# Altium schematic sheet Power Schematic.SchDoc
size A4; SheetNumber: 2; SheetTotal: 3
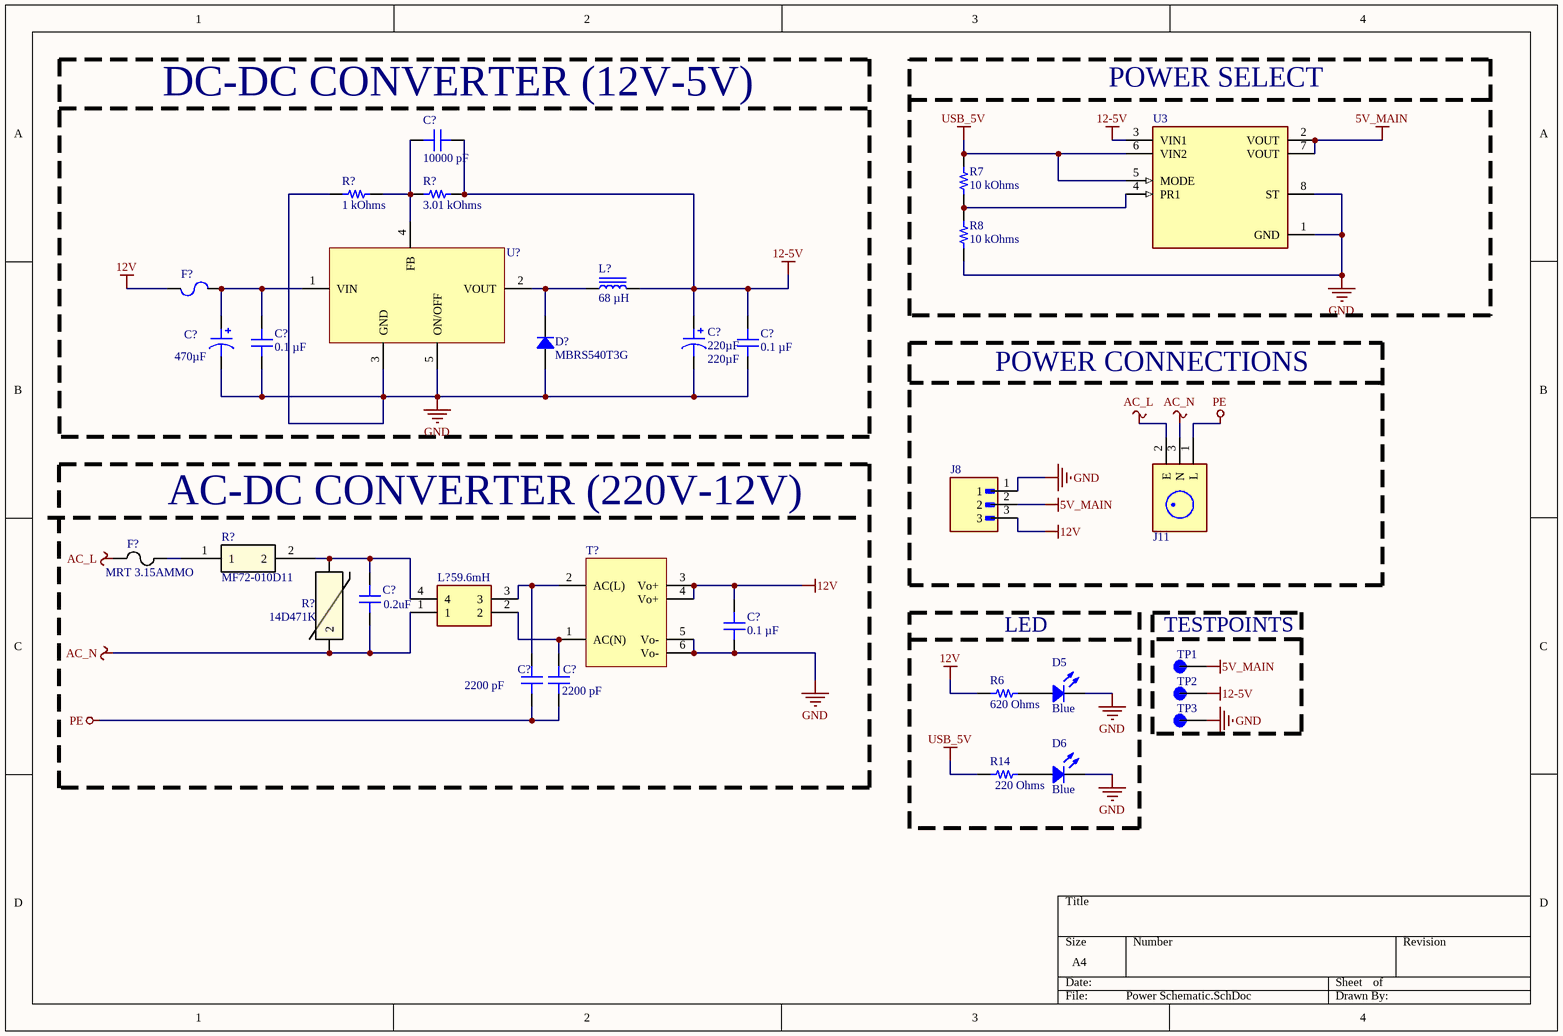
[diagram p0: Power Schematic.SchDoc]

## Parts
(Parts that share a designator on the sheet are numbered #1, #2 ... from top to bottom, then left to right.)
C?#1  10000 pF  [CAP 0603_1608]
C?#2  470µF  [CAP TH ALUM ELEC D12.50mm S5.00mm H27.00mm]
C?#3  0.1 µF  [CAP 0603_1608]
C?#4  220µF  [CAP TH ALUM ELEC D8.00mm S3.50mm H16.50mm]
C?#5  0.1 µF  [CAP 0603_1608]
C?#6  Capacitance: 0.2uF  [CAP_R46KI322040M2K_KEM]  (hidden comment: R46KI322040M2K)
C?#7  0.1 µF  [CAP 0603_1608]
C?#8  Capacitance: 2200 pF  [G10E1E222MN0B0S0N0]  (hidden comment: G10E1E222MN0B0S0N0)
C?#9  Capacitance: 2200 pF  [G10E1E222MN0B0S0N0]  (hidden comment: G10E1E222MN0B0S0N0)
D5  Blue  [LED 0805_2012 BLUE]
D6  Blue  [LED 0805_2012 BLUE]
D?  MBRS540T3G  [DO214AB SMC]
F?#1  SF-1206S300-2  [FUSE 0402_1005 0.51MM]  (value not drawn)
F?#2  MRT 3.15AMMO  [MRT_BEL]
J8  61300311121  [WURTH_61300311121]  (value not drawn)
J11  703W-00/52  [QUALTEK_703W-00/52]  (value not drawn)
L?#1  68 µH  [WURTH WE-PD 1210]
L?#2  value 59.6mH  [SSRH7HM04596]  (hidden comment: SSRH7H-M04596)
R6  620 Ohms  [YAGEO RES RK73 RS73 SG73 0805_2012]
R7  10 kOhms  [YAGEO RES 0603_1608]
R8  10 kOhms  [YAGEO RES 0603_1608]
R14  220 Ohms  [YAGEO RES 0805_2012]
R?#1  1 kOhms  [YAGEO RES 0603_1608]
R?#2  3.01 kOhms  [YAGEO RES 0603_1608]
R?#3  MF72-010D11  [MF72-010D11_CTM]
R?#4  14D471K  [VARS_B72214S_15p5x5p4-7p5_TDK]
T?  AP12N24  [POWER MODULE 49x36mm]  (value not drawn)
TP1  5115  [KEYSTONE_5115]  (value not drawn)
TP2  5115  [KEYSTONE_5115]  (value not drawn)
TP3  5115  [KEYSTONE_5115]  (value not drawn)
U3  TPS2116DRLR  [SOTFL50P160X60-8N]  (value not drawn)
U?  LM2596S-ADJ/NOPB  [LM2596]  (value not drawn)

## Blocks framed on the sheet
DC-DC CONVERTER (12V-5V): C?#1-C?#5 D? F?#1 L?#1 R?#1 R?#2 U?
POWER SELECT: R7 R8 U3
POWER CONNECTIONS: J8 J11
AC-DC CONVERTER (220V-12V): C?#6-C?#9 F?#2 L?#2 R?#3 R?#4 T?
LED: D5 D6 R6 R14
TESTPOINTS: TP1-TP3

## Nets
5V_MAIN: J8.2 TP1.TP U3.2(VOUT) U3.7(VOUT)
12-5V: C?#1.2 C?#4.1 C?#5.2 L?#1.2 R?#2.2 TP2.TP U3.3(VIN1)
12V: C?#7.2 F?#1.1 J8.3 R6.1 T?.3(Vo+) T?.4(Vo+)
AC_L: F?#2.1 J11.2(E)
AC_N: C?#6.1 J11.3(N) L?#2.1 R?#4.2
GND: C?#2.2 C?#3.1 C?#4.2 C?#5.1 C?#7.1 D5.2 D6.2 D?.1 J8.1 R8.1 R?#1.1 T?.5(Vo-) T?.6(Vo-) TP3.TP U3.1(GND) U3.8(ST) U?.3(GND) U?.5(ON/OFF)
PE: C?#8.1 C?#9.1 J11.1(L)
USB_5V: R7.2 R14.1 U3.5(MODE) U3.6(VIN2)
NetC?#1_1: C?#1.1 R?#1.2 R?#2.1 U?.4(FB)
NetC?#2_1: C?#2.1 C?#3.2 F?#1.2 U?.1(VIN)
NetC?#6_2: C?#6.2 L?#2.4 R?#3.2 R?#4.1
NetC?#8_2: C?#8.2 L?#2.3 T?.2(AC(L))
NetC?#9_2: C?#9.2 L?#2.2 T?.1(AC(N))
NetD5_1: D5.1 R6.2
NetD6_1: D6.1 R14.2
NetD?_2: D?.2 L?#1.1 U?.2(VOUT)
NetF?#2_2: F?#2.2 R?#3.1
NetR7_1: R7.1 R8.2 U3.4(PR1)

## Library data of the parts
C?#1 = KAF15AR71H103KT: CAP CER 10000PF 50V X7R 0603; manufacturer: KYOCERA AVX; Tolerance: ±10%; Part Number: KAF15AR71H103KT; Applications: Automotive, Boardflex Sensitive; componentlink1description: Datasheet; componentlink1url: https://datasheets.kyocera-avx.com/AutoMLCC.pdf; componentlink2description: DigiKey Link; componentlink2url: https://www.digikey.com/en/products/detail/kyocera-avx/KAF15AR71H103KT/3660860; Device Package: 0603 (1608 Metric); Features: Soft Termination; lastupdated: 9.02.2024 20:09:12; Lifecycle Status: Active; Minimum Order: 1; Mounting Type: Surface Mount, MLCC; Operating Temperature: -55°C ~ 125°C; Package / Case: 0603 (1608 Metric); packaging: TapeAndReel; partid: 52545; Part Status: Active; price: 0.03; Ratings: AEC-Q200; series: FLEXITERM®; Size / Dimension: 0.063" L x 0.032" W (1.60mm x 0.81mm); Supplier 1: DigiKey; Supplier Part Number 1: 478-KAF15AR71H103KTCT-ND; Temperature Coefficient: X7R; Thickness (Max): 0.035" (0.90mm); value: 10000 pF; Voltage - Rated: 50V; Capacitance: 10000 pF
C?#2 = EEU-FC1H471B: CAP ALUM 470UF 20% 50V RADIAL; manufacturer: Panasonic Electronic Components; Impedance: 50 mOhms; Lifetime @ Temp.: 5000 Hrs @ 105°C; Polarization: Polar; Ripple Current @ High Frequency: 1.832A @ 100kHz; Ripple Current @ Low Frequency: 1.374A @ 120Hz; Part Number: EEU-FC1H471B; Applications: Automotive; componentlink1description: Datasheet; componentlink1url: http://industrial.panasonic.com/www-cgi/jvcr13pz.cgi?E+PZ+3+ABA0022+EEUFC1H471B+7+WW; componentlink2description: DigiKey Link; componentlink2url: http://digikey.com/product-detail/en/panasonic-electronic-components/EEU-FC1H471B/P19660CT-ND/6109558; Device Package: Radial, Can; Height - Seated (Max): 1.063" (27.00mm); lastupdated: 2.09.2020 01:32:14; Lead Spacing: 0.197" (5.00mm); Lifecycle Status: Active; Minimum Order: 1; Mounting Type: Through Hole; Operating Temperature: -55°C ~ 105°C; Package / Case: Radial, Can; packaging: TapeAndBox; partid: 15215; Part Status: Active; price: 0.43; Ratings: AEC-Q200; series: FC; Size / Dimension: 0.492" Dia (12.50mm); Supplier 1: DigiKey; Supplier Part Number 1: P19660CT-ND; Tolerance: ±20%; value: 470µF; Voltage - Rated: 50V; Capacitance: 470µF
C?#3 C?#5 = C0603X104M3RAC7867: CAP CER 0.1UF 25V X7R 0603; manufacturer: KEMET; Tolerance: ±20%; Part Number: C0603X104M3RAC7867; Applications: Boardflex Sensitive; componentlink1description: Datasheet; componentlink1url: https://api.kemet.com/component-edge/download/datasheet/C0603X104M3RACTU.pdf; componentlink2description: DigiKey Link; componentlink2url: https://www.digikey.com/en/products/detail/kemet/C0603X104M3RAC7867/2202613; Device Package: 0603 (1608 Metric); Features: Soft Termination; lastupdated: 9.02.2024 20:10:30; Lifecycle Status: Active; Minimum Order: 1; Mounting Type: Surface Mount, MLCC; Operating Temperature: -55°C ~ 125°C; Package / Case: 0603 (1608 Metric); packaging: TapeAndReel; partid: 2484; Part Status: Active; price: 0.06; series: SMD Comm X7R Flex; Size / Dimension: 0.063" L x 0.031" W (1.60mm x 0.80mm); Supplier 1: DigiKey; Supplier Part Number 1: 399-13148-1-ND; Temperature Coefficient: X7R; Thickness (Max): 0.034" (0.87mm); value: 0.1 µF; Voltage - Rated: 25V; Capacitance: 0.1 µF
C?#4 = EEU-FM1V221L: CAP ALUM 220UF 20% 35V RADIAL; manufacturer: Panasonic Electronic Components; Impedance: 41 mOhms; Lifetime @ Temp.: 3000 Hrs @ 105°C; Polarization: Polar; Ripple Current @ High Frequency: 1.24A @ 100kHz; Ripple Current @ Low Frequency: 868mA @ 120Hz; Part Number: EEU-FM1V221L; Applications: General Purpose; componentlink1description: Datasheet; componentlink1url: http://industrial.panasonic.com/www-cgi/jvcr13pz.cgi?E+PZ+3+ABA0108+EEUFM1V221L+7+WW; componentlink2description: DigiKey Link; componentlink2url: http://digikey.com/product-detail/en/panasonic-electronic-components/EEU-FM1V221L/P12412-ND/613773; Device Package: Radial, Can; Height - Seated (Max): 0.650" (16.50mm); lastupdated: 8.09.2020 02:47:34; Lead Spacing: 0.138" (3.50mm); Lifecycle Status: Active; Minimum Order: 1; Mounting Type: Through Hole; Operating Temperature: -40°C ~ 105°C; Package / Case: Radial, Can; packaging: Bulk; partid: 24542; Part Status: Active; price: 0.45; series: FM; Size / Dimension: 0.315" Dia (8.00mm); Supplier 1: DigiKey; Supplier Part Number 1: P12412-ND; Tolerance: ±20%; value: 220µF; Voltage - Rated: 35V; Capacitance: 220µF
C?#6 = R46KI322040M2K: R46_275, Film, Metallized Polypropylene, Safety, 0.22 uF, 10%, 275 VAC (X2), 560 VDC, 110Ã‚Â°C, Lead Spacing = 15mm; Manufacturer_Name: Kemet; Type: Film Capacitor; Copyright: Copyright (C) 2025 Ultra Librarian. All rights reserved.; Manufacturer_Part_Number: R46KI322040M2K; Datasheet: https://content.kemet.com/datasheets/KEM_F3093_R46_X2_275_110C.pdf; Digi-Key_Part_Number_1: 399-17016-ND
C?#7 = C0603C104K5RAC7411: CAP CER 0.1UF 50V X7R 0603; manufacturer: KEMET; Tolerance: ±10%; Part Number: C0603C104K5RAC7411; Applications: Bypass, Decoupling; componentlink1description: Datasheet; componentlink1url: https://api.kemet.com/component-edge/download/datasheet/C0603C104K5RAC7411.pdf; componentlink2description: DigiKey Link; componentlink2url: https://www.digikey.com/en/products/detail/kemet/C0603C104K5RAC7411/3317013; Device Package: 0603 (1608 Metric); lastupdated: 9.02.2024 20:10:30; Lifecycle Status: Active; Minimum Order: 1; Mounting Type: Surface Mount, MLCC; Operating Temperature: -55°C ~ 125°C; Package / Case: 0603 (1608 Metric); packaging: TapeAndReel; partid: 2233; Part Status: Active; price: 0.01; series: SMD Comm X7R; Size / Dimension: 0.063" L x 0.031" W (1.60mm x 0.80mm); Supplier 1: DigiKey; Supplier Part Number 1: 399-C0603C104K5RAC7411CT-ND; Temperature Coefficient: X7R; Thickness (Max): 0.035" (0.90mm); value: 0.1 µF; Voltage - Rated: 50V; Capacitance: 0.1 µF
C?#8 C?#9 = G10E1E222MN0B0S0N0: 2200 pF ±20% 250V Ceramic Capacitor Y5U (E) Radial, Disc; Ratings: X1, Y2; ComponentLink1Description: Digikey; ComponentLink1URL: https://www.digikey.com/en/products/detail/songtian-electronic-technology-hk-limited/G10E1E222MN0B0S0N0/13985619; Voltage - Rated: 250V; Tolerance: ±20%
D5 D6 = APT2012VBC/D: LED BLUE CLR CHIP SMD; Manufacturer: Kingbright; Configuration: Standard; Current - Test: 20mA; Lens Color: Colorless; Lens Size: 1.30mm x 1.25mm; Lens Style: Rectangle with Flat Top; Lens Transparency: Clear; Millicandela Rating: 180mcd; Viewing Angle: 120°; Voltage - Forward (Vf) (Typ): 3.3V; Wavelength - Dominant: 470nm; Wavelength - Peak: 465nm; Part Number: APT2012VBC/D; Color: Blue; ComponentLink1Description: Datasheet; ComponentLink1URL: http://www.kingbrightusa.com/images/catalog/SPEC/APT2012VBC-D.pdf; ComponentLink2Description: DigiKey Link; ComponentLink2URL: https://www.digikey.com/en/products/detail/kingbright/APT2012VBC-D/4098483; Device Package: 0805 (2012 Metric); Height (Max): 0.75mm; LastUpdated: 3.06.2024 19:58:02; Lifecycle Status: Active; Minimum Order: 1; Mounting Type: Surface Mount; Package / Case: 0805 (2012 Metric); Packaging: TapeAndReel; PartId: 755; Part Status: Active; Price: 0.13; Series: -; Size / Dimension: 2.00mm L x 1.25mm W; Supplier 1: DigiKey; Supplier Part Number 1: 754-1794-1-ND; Supplier Device Package: Chip LED; Value: Blue
D? = MBRS540T3G: DIODE SCHOTTKY 40V 5A SMC; Manufacturer: ON Semiconductor; Current - Reverse Leakage @ Vr: 300µA @ 40V; Speed: Fast Recovery =< 500ns, > 200mA (Io); Voltage - Forward (Vf) (Max) @ If: 500mV @ 5A; Part Number: MBRS540T3G; ComponentLink1Description: Datasheet; ComponentLink1URL: http://www.onsemi.com/pub/Collateral/MBRS540T3-D.PDF; ComponentLink2Description: DigiKey Link; ComponentLink2URL: http://digikey.com/product-detail/en/on-semiconductor/MBRS540T3G/MBRS540T3GOSCT-ND/918011; Current - Average Rectified (Io): 5A; Diode Type: Schottky; LastUpdated: 3.06.2024 19:54:13; Lifecycle Status: Active; Minimum Order: 1; Mounting Type: Surface Mount; Operating Temperature - Junction: -65°C ~ 150°C; Package / Case: DO-214AB, SMC; Packaging: TapeAndReel; PartId: 1713; Part Status: Active; Price: 0.17; Series: -; Supplier 1: DigiKey; Supplier Part Number 1: MBRS540T3GOSCT-ND; Supplier Device Package: SMC; Voltage - DC Reverse (Vr) (Max): 40V
F?#1 = SF-1206S300-2: FUSE BOARD MOUNT 3A 32VDC 1206; Part Number: SF-1206S300-2
F?#2 = MRT 3.15AMMO: FUSE; Manufacturer_Name: Belfuse; Copyright: Copyright (C) 2025 Ultra Librarian. All rights reserved.; Manufacturer_Part_Number: MRT 3.15AMMO; Digi-Key_Part_Number_1: 507-1116-3-ND; ComponentLink1Description: Link; ComponentLink1URL: https://www.digikey.com/en/products/detail/bel-fuse-inc/MRT-3-15-AMMO/615070
J11 = 703W-00/52: Mains Power Connector, 15A, 250VAC, Female, Solder Terminal, Receptacle; MF: Qualtek; Approvals: CSA, DEMKO, FIMKO, KEMA, NEMKO, SEMKO, UL, VDE; Connector Type: Pin, Receptacle; Fuse: No; Max Voltage Rating (AC): 250V; Number of Contacts: 3; Number of Poles: 2; Panel Thickness: 3.048mm; Pitch: 7mm; Availability: Unavailable; MP: 703W-00/52; Package: None; SnapEDA_Link: https://www.snapeda.com/parts/703W-00/52/Qualtek/view-part/46399/?ref=snap; Value: *; Price: None; Supplier 1: Mouser; Manufacturer: Qualtek; Manufacturer Part Number: 703W-00/52; RoHS: Compliant; Category: Power Connectors; Stock 1: 1479; Pricing 1: 1=1,54, 10=1,31, 50=1,17, 100=1,08, 1000=0,926, 10000=0,882 (USD); Color: Black; Contact Gender: Female; Contact Material: Tin; Contact Plating: Tin; Current: 15A; Current Rating: 15A; Gender: Receptacle; Height: 27.8mm; Housing Material: Thermoplastic; Lead Free: Lead Free; Lifecycle Status: Production; Max Current Rating: 15A; Mounting Technology: Flanges, PCB, Panel, Through Hole; Pins: 3; Number of Positions: 3; Orientation: Right Angle; REACH SVHC: Yes; Schedule B: 8536695050, 8536695050|8536695050|8536695050|8536695050|8536695050; Termination: Solder; Voltage Rating: 250V; Voltage Rating (AC): 250V; Voltage Rating (DC): 250V; ComponentLink1URL: https://datasheet.octopart.com:443/703W-00/52-Qualtek-datasheet-12512752.pdf?src-supplier=IHS; ComponentLink1Description: https://datasheet.octopart.com:443/703W-00/52-Qualtek-datasheet-12512752.pdf?src-supplier=IHS; ComponentLink2URL: https://datasheet.octopart.com:443/703W-00/52-Qualtek-datasheet-156925.pdf?src-supplier=Sager+Electronics; ComponentLink2Description: https://datasheet.octopart.com:443/703W-00/52-Qualtek-datasheet-156925.pdf?src-supplier=Sager+Electronics; ComponentLink3URL: https://datasheet.octopart.com:443/703W-00/52-Qualtek-datasheet-45059.pdf?src-supplier=RS+(Formerly+Allied+Electronics); ComponentLink3Description: https://datasheet.octopart.com:443/703W-00/52-Qualtek-datasheet-45059.pdf?src-supplier=RS+(Formerly+Allied+Electronics); ComponentLink4URL: https://datasheet.octopart.com:443/703W-00/52-Qualtek-datasheet-138486.pdf?src-supplier=DigiKey; ComponentLink4Description: https://datasheet.octopart.com:443/703W-00/52-Qualtek-datasheet-138486.pdf?src-supplier=DigiKey; Supplier Part Number 1: 562-703W-00/52
L?#1 = 7447709680: FIXED IND 68UH 3.2A 89 MOHM SMD; Manufacturer: Würth Elektronik; Current - Saturation: 3.6A; DC Resistance (DCR): 89mOhm Max; Frequency - Self Resonant: 5.5MHz; Inductance Frequency - Test: 1 kHz; Material - Core: Ferrite; Shielding: Shielded; Tolerance: ±20%; Type: Drum Core, Wirewound; Part Number: 7447709680; ComponentLink1Description: Datasheet; ComponentLink1URL: https://katalog.we-online.de/pbs/datasheet/7447709680.pdf; ComponentLink2Description: DigiKey Link; ComponentLink2URL: https://www.digikey.com/en/products/detail/würth-elektronik/7447709680/1638652; Current Rating (Amps): 3.2 A; Device Package: Nonstandard; Height - Seated (Max): 0.394" (10.00mm); Inductance: 68 µH; LastUpdated: 3.06.2024 20:26:17; Lifecycle Status: Active; Minimum Order: 1; Mounting Type: Surface Mount; Operating Temperature: -40°C ~ 125°C; Package / Case: Nonstandard; Packaging: TapeAndReel; PartId: 5691; Part Status: Active; Price: 1.48; Ratings: AEC-Q200; Series: WE-PD; Size / Dimension: 0.472" L x 0.472" W (12.00mm x 12.00mm); Supplier 1: DigiKey; Supplier Part Number 1: 732-1247-1-ND; Supplier Device Package: 1212; Value: 68 µH
L?#2 = SSRH7H-M04596: Common Mode Chokes Dual 59600uH 10kHz 0.4A 2.02Ohm DCR Thru-Hole Tray; Manufacturer_Name: KEMET; Geometry.Height: 12mm; Approvals: UL; Current Rating: 400mA; Insulation Resistance: 100MΩ; Voltage Rating: 250V; Mouser Part Number: 80-SSRH7H-M04596; Mouser Price/Stock: https://www.mouser.co.uk/ProductDetail/KEMET/SSRH7H-M04596?qs=r5DSvlrkXmJdXW%2FbuXmveA%3D%3D; Manufacturer_Part_Number: SSRH7H-M04596; Datasheet Link: https://content.kemet.com/datasheets/KEM_LF0040_SSRH7H-M.pdf; Supplier 1: Arrow Electronics; Manufacturer: KEMET; Manufacturer Part Number: SSRH7H-M04596; RoHS: Compliant; Category: Common Mode Chokes; Stock 1: 22200; Pricing 1: 100=0,6846, 300=0,678, 500=0,677, 1000=0,664, 5000=0,655 (USD); Height: 12mm; Length: 18mm; Lifecycle Status: Production; Max Operating Temperature: 120°C; Min Operating Temperature: -25°C; REACH SVHC: Yes; Width: 14.5mm; ComponentLink1URL: https://datasheet.octopart.com:443/SSRH7H-M04596-KEMET-datasheet-180505042.pdf?src-supplier=TME; ComponentLink1Description: https://datasheet.octopart.com:443/SSRH7H-M04596-KEMET-datasheet-180505042.pdf?src-supplier=TME; ComponentLink2URL: https://datasheet.octopart.com:443/SSRH7H-M04596-KEMET-datasheet-181844466.pdf?src-supplier=TME; ComponentLink2Description: https://datasheet.octopart.com:443/SSRH7H-M04596-KEMET-datasheet-181844466.pdf?src-supplier=TME; ComponentLink3URL: https://datasheet.octopart.com:443/SSRH7H-M04596-KEMET-datasheet-119327233.pdf?src-supplier=TME; ComponentLink3Description: https://datasheet.octopart.com:443/SSRH7H-M04596-KEMET-datasheet-119327233.pdf?src-supplier=TME; ComponentLink4URL: https://datasheet.octopart.com:443/SSRH7H-M04596-KEMET-datasheet-118607337.pdf?src-supplier=TME; ComponentLink4Description: https://datasheet.octopart.com:443/SSRH7H-M04596-KEMET-datasheet-118607337.pdf?src-supplier=TME; ComponentLink5URL: https://datasheet.octopart.com:443/SSRH7H-M04596-KEMET-datasheet-141259685.pdf?src-supplier=Newark; ComponentLink5Description: https://datasheet.octopart.com:443/SSRH7H-M04596-KEMET-datasheet-141259685.pdf?src-supplier=Newark; ComponentLink6URL: https://datasheet.octopart.com:443/SSRH7H-M04596-KEMET-datasheet-182797630.pdf?src-supplier=Master+Electronics; ComponentLink6Description: https://datasheet.octopart.com:443/SSRH7H-M04596-KEMET-datasheet-182797630.pdf?src-supplier=Master+Electronics; Supplier Part Number 1: SSRH7H-M04596
R6 = RK73H2ATTD6200F: RES 620 OHM 1% 1/4W 0805; Manufacturer: KOA Speer Electronics, Inc.; Power (Watts): 0.25W, 1/4W; Temperature Coefficient: ±100ppm/°C; Part Number: RK73H2ATTD6200F; ComponentLink1Description: Datasheet; ComponentLink1URL: http://www.koaspeer.com/catimages/Products/RK73H/RK73H.pdf; ComponentLink2Description: DigiKey Link; ComponentLink2URL: https://www.digikey.com/en/products/detail/koa-speer-electronics-inc/RK73H2ATTD6200F/10234040; Composition: Thick Film; Device Package: 0805 (2012 Metric); Features: Automotive AEC-Q200; Height - Seated (Max): 0.024" (0.60mm); LastUpdated: 25.07.2024 09:45:22; Lifecycle Status: Active; Minimum Order: 1; Number of Terminations: 2; Operating Temperature: -55°C ~ 155°C; Package / Case: 0805 (2012 Metric); Packaging: CutTape; PartId: 33904; Part Status: Active; Price: 0.01; Ratings: AEC-Q200; Resistance: 620 Ohms; Series: RK73H; Size / Dimension: 0.079" L x 0.049" W (2.00mm x 1.25mm); Supplier 1: DigiKey; Supplier Part Number 1: 2019-RK73H2ATTD6200FCT-ND; Supplier Device Package: 0805; Tolerance: ±1%; Value: 620 Ohms
R7 R8 = RT0603FRE0710KL: RES SMD 10K OHM 1% 1/10W 0603; Manufacturer: Yageo; Power (Watts): 0.1W, 1/10W; Temperature Coefficient: ±50ppm/°C; Part Number: RT0603FRE0710KL; ComponentLink1Description: Datasheet; ComponentLink1URL: https://www.yageo.com/upload/media/product/productsearch/datasheet/rchip/PYu-RT_1-to-0.01_RoHS_L_11.pdf; ComponentLink2Description: DigiKey Link; ComponentLink2URL: https://www.digikey.com/en/products/detail/yageo/RT0603FRE0710KL/1075040; Composition: Thin Film; Device Package: 0603 (1608 Metric); Height - Seated (Max): 0.022" (0.55mm); LastUpdated: 25.07.2024 09:19:32; Lifecycle Status: Active; Minimum Order: 1; Number of Terminations: 2; Operating Temperature: -55°C ~ 155°C; Package / Case: 0603 (1608 Metric); Packaging: TapeAndReel; PartId: 5671; Part Status: Active; Price: 0.01; Resistance: 10 kOhms; Series: RT; Size / Dimension: 0.063" L x 0.031" W (1.60mm x 0.80mm); Supplier 1: DigiKey; Supplier Part Number 1: YAG2321CT-ND; Supplier Device Package: 0603; Tolerance: ±1%; Value: 10 kOhms
R14 = AC0805FR-7W220RL: RES 220 OHM 1% 1/4W 0805; Manufacturer: Yageo; Power (Watts): 0.25W, 1/4W; Temperature Coefficient: ±100ppm/°C; Part Number: AC0805FR-7W220RL; ComponentLink1Description: Datasheet; ComponentLink1URL: https://www.yageo.com/upload/media/product/productsearch/datasheet/rchip/PYu-AC_51_RoHS_L_10.pdf; ComponentLink2Description: DigiKey Link; ComponentLink2URL: https://www.digikey.com/en/products/detail/yageo/AC0805FR-7W220RL/17022423; Composition: Thick Film; Device Package: 0805 (2012 Metric); Features: Automotive AEC-Q200, Moisture Resistant; Height - Seated (Max): 0.024" (0.60mm); LastUpdated: 25.07.2024 09:19:55; Lifecycle Status: Active; Minimum Order: 1; Number of Terminations: 2; Operating Temperature: -55°C ~ 155°C; Package / Case: 0805 (2012 Metric); Packaging: TapeAndReel; PartId: 87434; Price: 0.01; Ratings: AEC-Q200; Resistance: 220 Ohms; Series: AC; Size / Dimension: 0.079" L x 0.049" W (2.00mm x 1.25mm); Supplier 1: DigiKey; Supplier Part Number 1: 13-AC0805FR-7W220RLCT-ND; Supplier Device Package: 0805; Tolerance: ±1%; Value: 220 Ohms
R?#1 = RT0603BRD071KL: RES SMD 1K OHM 0.1% 1/10W 0603; Manufacturer: Yageo; Power (Watts): 0.1W, 1/10W; Temperature Coefficient: ±25ppm/°C; Part Number: RT0603BRD071KL; ComponentLink1Description: Datasheet; ComponentLink1URL: https://www.yageo.com/upload/media/product/productsearch/datasheet/rchip/PYu-RT_1-to-0.01_RoHS_L_11.pdf; ComponentLink2Description: DigiKey Link; ComponentLink2URL: https://www.digikey.com/en/products/detail/yageo/RT0603BRD071KL/1072344; Composition: Thin Film; Device Package: 0603 (1608 Metric); Height - Seated (Max): 0.022" (0.55mm); LastUpdated: 25.07.2024 09:19:32; Lifecycle Status: Active; Minimum Order: 1; Number of Terminations: 2; Operating Temperature: -55°C ~ 155°C; Package / Case: 0603 (1608 Metric); Packaging: TapeAndReel; PartId: 5625; Part Status: Active; Price: 0.03; Resistance: 1 kOhms; Series: RT; Size / Dimension: 0.063" L x 0.031" W (1.60mm x 0.80mm); Supplier 1: DigiKey; Supplier Part Number 1: YAG1237CT-ND; Supplier Device Package: 0603; Tolerance: ±0.1%; Value: 1 kOhms
R?#2 = ERJ-3EKF3011V: RES SMD 3.01K OHM 1% 1/10W 0603; Manufacturer: Panasonic Electronic Components; Power (Watts): 0.1W, 1/10W; Temperature Coefficient: ±100ppm/°C; Part Number: ERJ-3EKF3011V; ComponentLink1Description: Datasheet; ComponentLink1URL: https://industrial.panasonic.com/cdbs/www-data/pdf/RDA0000/AOA0000C304.pdf; ComponentLink2Description: DigiKey Link; ComponentLink2URL: https://www.digikey.com/en/products/detail/panasonic-electronic-components/ERJ-3EKF3011V/196267; Composition: Thick Film; Device Package: 0603 (1608 Metric); Features: Automotive AEC-Q200; Height - Seated (Max): 0.022" (0.55mm); LastUpdated: 9.02.2024 20:43:34; Lifecycle Status: Active; Minimum Order: 1; Number of Terminations: 2; Operating Temperature: -55°C ~ 155°C; Package / Case: 0603 (1608 Metric); Packaging: TapeAndReel; PartId: 5650; Part Status: Active; Price: 0.01; Ratings: AEC-Q200; Resistance: 3.01 kOhms; Series: ERJ-3EK; Size / Dimension: 0.063" L x 0.031" W (1.60mm x 0.80mm); Supplier 1: DigiKey; Supplier Part Number 1: P3.01KHCT-ND; Supplier Device Package: 0603; Tolerance: ±1%; Value: 3.01 kOhms
R?#3 = MF72-010D11: INRUSH CURRENT LIMITER; Manufacturer_Name: CANTHERM; Copyright: Copyright (C) 2025 Ultra Librarian. All rights reserved.; Manufacturer_Part_Number: MF72-010D11; RefDes: RefDes; Type: Type
R?#4 = 14D471K: Metal oxide varistor, radial, VV 470 V, 4500 A, 385 V (DC), 300 V (AC), ±10 %, 125 J; Manufacturer: Bourns; Manufacturer Part Number: MOV-14D471K; Value: 516pF; Clamping Current: 50A; Clamping Voltage: 775V; Energy: 125J; Max Surge Current: 4.5kA; Max Varistor Voltage: 517V; Max Voltage Rating (AC): 300V; Max Voltage Rating (DC): 385V; Min Varistor Voltage: 423V; Number of Circuits: 1; Power Dissipation: 600mW; Tolerance: 10%; Supplier 1: Farnell; RoHS: Compliant; Category: Varistors; Stock 1: 1139; Pricing 1: 1=0,304, 10=0,192, 50=0,186, 100=0,169, 200=0,16, 600=0,146 (EUR); Case/Package: Radial; China RoHS: Compliant; Contact Plating: Tin; Current Rating: 50A; Depth: 5.4mm; Diameter: 14mm; Height: 20mm; Lead/Base Style: Radial; Lead Pitch: 7.5mm; Lifecycle Status: Production; Max Operating Temperature: 105°C; Min Operating Temperature: -40°C; Mounting Technology: Radial, Through Hole; Number of Terminals: 2; Packaging: Bulk; Power Rating: 600mW; Radiation Hardening: No; REACH SVHC: Yes; Schedule B: 8533400080, 8533400080|8533400080|8533400080|8533400080|8533400080; Thickness: 5.4mm; Varistor Voltage: 423V; Voltage Rating (AC): 300V; Voltage Rating (DC): 385V; Voltage Tolerance: 10%; Weight: 3.000003g; Width: 5.4mm; Working Voltage: 385V; ComponentLink1URL: https://datasheet.octopart.com:443/MOV-14D471K-Bourns-datasheet-182141936.pdf?src-supplier=IHS; ComponentLink1Description: https://datasheet.octopart.com:443/MOV-14D471K-Bourns-datasheet-182141936.pdf?src-supplier=IHS; ComponentLink2URL: https://datasheet.octopart.com:443/MOV-14D471K-Bourns-datasheet-17269412.pdf?src-supplier=Farnell; ComponentLink2Description: https://datasheet.octopart.com:443/MOV-14D471K-Bourns-datasheet-17269412.pdf?src-supplier=Farnell; ComponentLink3URL: https://datasheet.octopart.com:443/MOV-14D471K-Bourns-datasheet-154729739.pdf?src-supplier=Electro+Sonic; ComponentLink3Description: https://datasheet.octopart.com:443/MOV-14D471K-Bourns-datasheet-154729739.pdf?src-supplier=Electro+Sonic; ComponentLink4URL: https://datasheet.octopart.com:443/MOV-14D471K-Bourns-datasheet-94104130.pdf?src-supplier=element14+APAC; ComponentLink4Description: https://datasheet.octopart.com:443/MOV-14D471K-Bourns-datasheet-94104130.pdf?src-supplier=element14+APAC; ComponentLink5URL: https://datasheet.octopart.com:443/MOV-14D471K-Bourns-datasheet-81453702.pdf?src-supplier=element14+APAC; ComponentLink5Description: https://datasheet.octopart.com:443/MOV-14D471K-Bourns-datasheet-81453702.pdf?src-supplier=element14+APAC; ComponentLink6URL: https://datasheet.octopart.com:443/MOV-14D471K-Bourns-datasheet-62136932.pdf?src-supplier=Newark; ComponentLink6Description: https://datasheet.octopart.com:443/MOV-14D471K-Bourns-datasheet-62136932.pdf?src-supplier=Newark; ComponentLink7URL: https://datasheet.octopart.com:443/MOV-14D471K-Bourns-datasheet-44494289.pdf?src-supplier=Newark; ComponentLink7Description: https://datasheet.octopart.com:443/MOV-14D471K-Bourns-datasheet-44494289.pdf?src-supplier=Newark; ComponentLink8URL: https://datasheet.octopart.com:443/MOV-14D471K-Bourns-datasheet-177040286.pdf?src-supplier=Burklin+Elektronik; ComponentLink8Description: https://datasheet.octopart.com:443/MOV-14D471K-Bourns-datasheet-177040286.pdf?src-supplier=Burklin+Elektronik; ComponentLink9URL: https://datasheet.octopart.com:443/MOV-14D471K-Bourns-datasheet-154729740.pdf?src-supplier=Burklin+Elektronik; ComponentLink9Description: https://datasheet.octopart.com:443/MOV-14D471K-Bourns-datasheet-154729740.pdf?src-supplier=Burklin+Elektronik; ComponentLink10URL: https://datasheet.octopart.com:443/MOV-14D471K-Bourns-datasheet-12546711.pdf?src-supplier=_legacy+Avnet; ComponentLink10Description: https://datasheet.octopart.com:443/MOV-14D471K-Bourns-datasheet-12546711.pdf?src-supplier=_legacy+Avnet; ComponentLink11URL: https://datasheet.octopart.com:443/MOV-14D471K-Bourns-datasheet-11048556.pdf?src-supplier=RS+(Formerly+Allied+Electronics); ComponentLink11Description: https://datasheet.octopart.com:443/MOV-14D471K-Bourns-datasheet-11048556.pdf?src-supplier=RS+(Formerly+Allied+Electronics); ComponentLink12URL: http://sigma.octopart.com:80/conflict_mineral_statement/Bourns-company-36.pdf?src-supplier=Compliance+Statements; ComponentLink12Description: http://sigma.octopart.com:80/conflict_mineral_statement/Bourns-company-36.pdf?src-supplier=Compliance+Statements; Supplier Part Number 1: 3373349
T? = HIECUBE AP12N24-Zero: 12V 85VAC~265VAC 2A 100V~370V 24W 87% AC/DC-DC Through Hole,49x36mm AC-DC Power Modules ROHS; ComponentLink1Description: DATASHEET; ComponentLink1URL: http://www.hiecube.com/wap/hypx/detail/id/10127
TP1-TP3 = 5115: Test Point Miniature THM H .300 Nylon 46 Insulated Brown PhosBronze/Silver | Keystone Electronics 5115; SnapEDA_Link: https://www.snapeda.com/parts/5115/Keystone/view-part/?ref=snap; Package: None; Value: *; MF: Keystone Electronics; MP: 5115; Check_prices: https://www.snapeda.com/parts/5115/Keystone/view-part/?ref=eda
U3 = TPS2116DRLR: 1.6-V to 5.5-V, 40-mâ„¦, 2.5-A, low-IQ, priority power multiplexer; MF: Texas Instruments; SnapEDA_Link: https://www.snapeda.com/parts/TPS2116DRLR/Texas+Instruments/view-part/?ref=snap; Package: None; Value: *; MP: TPS2116DRLR; Check_prices: https://www.snapeda.com/parts/TPS2116DRLR/Texas+Instruments/view-part/?ref=eda
U? = LM2596: Pwr Sply Func, Voltage Regulator, Buck, Switching, TO-263, IS 5mA, VO 1.2 to 37V; Manufacturer: TI National Semiconductor; Number of Outputs: 1; Max Output current: 3A; Min Input Voltage: 4.5V; Max Supply Voltage: 40V; Switching Frequency: 173kHz; Efficiency: 73%; Min Output Voltage: 1.2V; Output Type: Adjustable; Max Duty Cycle: 100%; Number of Channels: 1NUMBER; designed by: berkay; Supplier: Mouser; Supplier Part Number: 926-LM2596S-ADJ/NOPB; Manufacturer Part Number: LM2596S-ADJ/NOPB; RoHS: Yes; Category: Voltage Regulators - Switching; Stock: 1472; Pricing: 1=9,04, 10=6,42, 50=6,13, 100=5,32, 1000=4,63, 10000=4,1 (USD); Mounting Technology: Surface Mount; Case/Package: TO-263; Pins: 5; Weight: 0.056128oz; Min Operating Temperature: -40°C; Max Operating Temperature: 125°C; Output Voltage: 37V; Packaging: Rail/Tube; Output Current: 3A; Max Output Voltage: 37V; Quiescent Current: 5mA; Operating Supply Voltage: 40V; Series: LM2596; Length: 10.16mm; Width: 8.64mm; Height: 4.57mm; Thickness: 4.58mm; Radiation Hardening: No; Reach SVHC Compliant: No; RoHS Compliant: Yes; ComponentLink1URL: https://datasheet.ciiva.com/27056/2051160-27056491.pdf?src-supplier=Jameco; ComponentLink1Description: https://datasheet.ciiva.com/27056/2051160-27056491.pdf?src-supplier=Jameco; ComponentLink2URL: https://datasheet.ciiva.com/15112/getdatasheetpartid-55559-15112636.pdf?src-supplier=Verical; ComponentLink2Description: https://datasheet.ciiva.com/15112/getdatasheetpartid-55559-15112636.pdf?src-supplier=Verical; ComponentLink3URL: https://datasheet.ciiva.com/41457/001013814-da-01-en-ic-reg-buc-lm2596s-adj-nopb-to-263-5-tid-41457756.pdf?src-supplier=Conrad; ComponentLink3Description: https://datasheet.ciiva.com/41457/001013814-da-01-en-ic-reg-buc-lm2596s-adj-nopb-to-263-5-tid-41457756.pdf?src-supplier=Conrad; ComponentLink4URL: https://datasheet.ciiva.com/22669/1874590-22669464.pdf?src-supplier=Element14; ComponentLink4Description: https://datasheet.ciiva.com/22669/1874590-22669464.pdf?src-supplier=Element14; ComponentLink5URL: https://datasheet.ciiva.com/14150/jqlm2596x-xx-e-14150653.pdf?src-supplier=Distrelec; ComponentLink5Description: https://datasheet.ciiva.com/14150/jqlm2596x-xx-e-14150653.pdf?src-supplier=Distrelec; ComponentLink6URL: https://datasheet.ciiva.com/6596/lm2596-6596342.pdf?src-supplier=Digikey; ComponentLink6Description: https://datasheet.ciiva.com/6596/lm2596-6596342.pdf?src-supplier=Digikey
J8 = 61300311121: Package: None; Price: None; Value: *; MP: 61300311121; Availability: Unavailable